# EAGLE design BM833 (EAGLE 9.6.2)

## Sheet 1 of 3
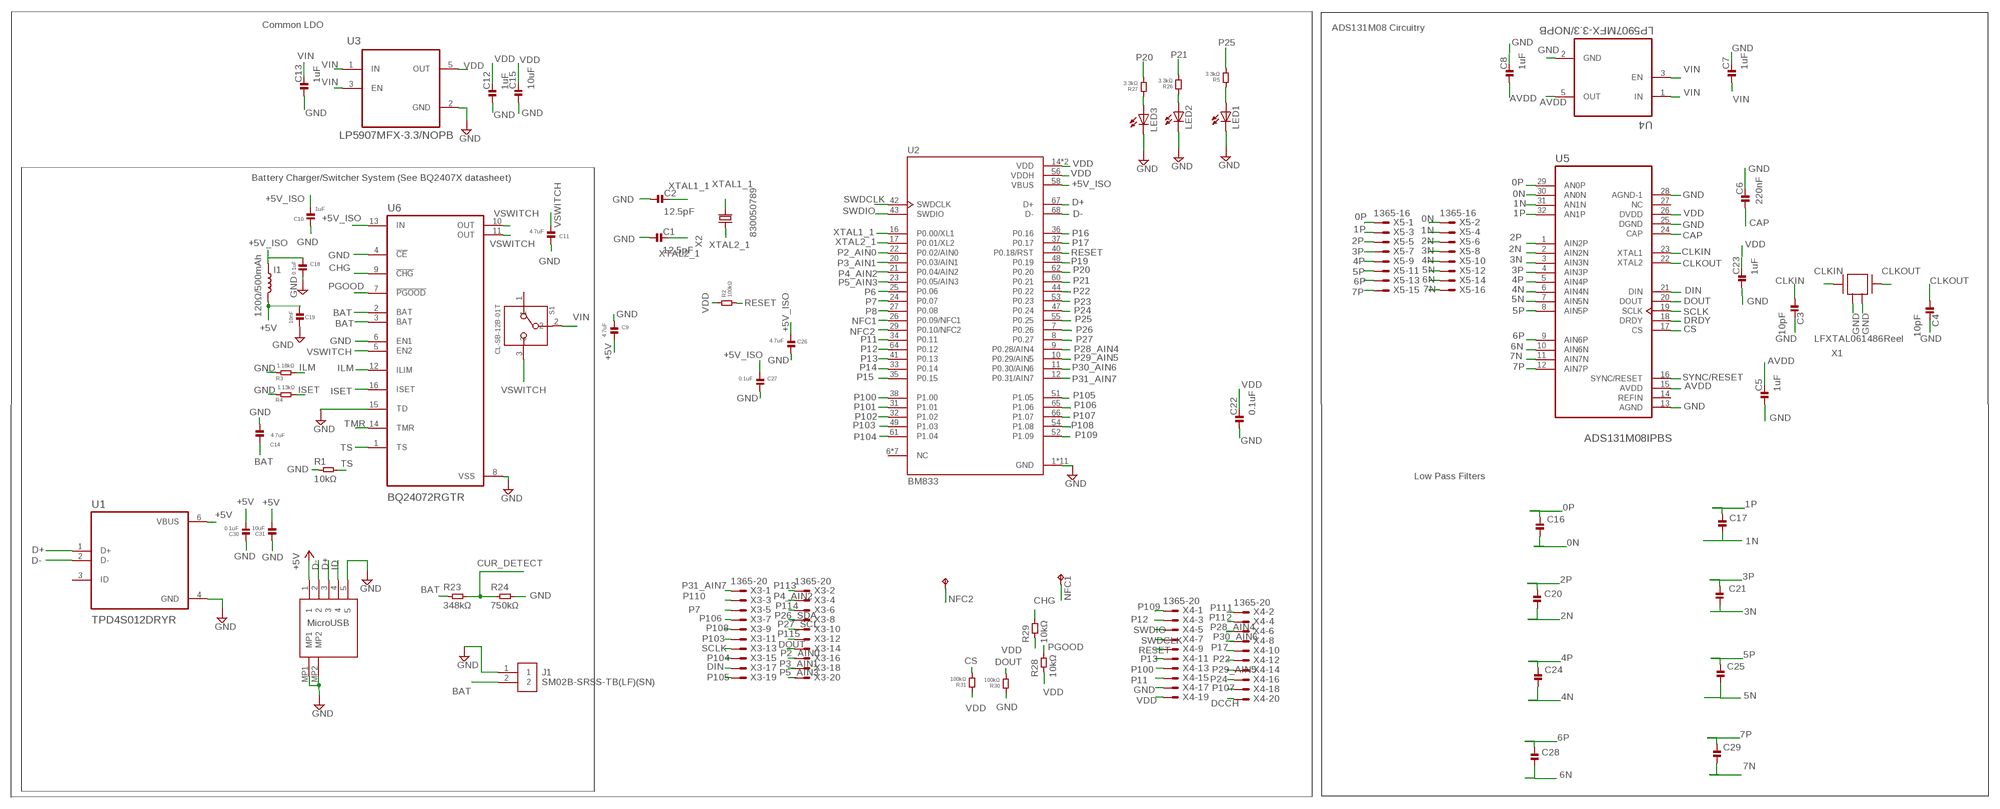
[diagram p0: schematic, sheet 1]

### Parts
C1  12.5pF  CAPACITOR.0201  [0201]
C2  12.5pF  CAPACITOR.0201  [0201]
C3  10pF  CAPACITOR.0201  [0201]
C4  10pF  CAPACITOR.0201  [0201]
C5  1uF  CAPACITOR.0201  [0201]
C6  220nF  CAPACITOR.0201  [0201]
C7  1uF  CAPACITOR.0201  [0201]
C8  1uF  CAPACITOR.0201  [0201]
C9  4.7uF  CAPACITOR.0201  [0201]
C10  1uF  CAPACITOR.0201  [0201]
C11  4.7uF  CAPACITOR.0201  [0201]
C12  1uF  CAPACITOR.0201  [0201]
C13  1uF  CAPACITOR.0201  [0201]
C14  4.7uF  CAPACITOR.0201  [0201]
C15  10uF  CAPACITOR.0402  [0402]
C16  100pF  CAPACITOR.0201  [0201]
C17  100pF  CAPACITOR.0201  [0201]
C18  0.1uF  CAPACITOR.0201  [0201]
C19  10nF  CAPACITOR.0201  [0201]
C20  100pF  CAPACITOR.0201  [0201]
C21  100pF  CAPACITOR.0201  [0201]
C22  0.1uF  CAPACITOR.0201  [0201]
C23  1uF  CAPACITOR.0201  [0201]
C24  100pF  CAPACITOR.0201  [0201]
C25  100pF  CAPACITOR.0201  [0201]
C26  4.7uF  CAPACITOR.0201  [0201]
C27  0.1uF  CAPACITOR.0201  [0201]
C28  100pF  CAPACITOR.0201  [0201]
C29  100pF  CAPACITOR.0201  [0201]
C30  0.1uF  CAPACITOR.0201  [0201]
C31  10uF  CAPACITOR.0402  [0402]
I1  120Ω/500mAh  12NH-0402  [0402_COILCRAFT]
J1  SM02B-SRSS-TB(LF)(SN)  [SM02B-SRSS-TB(LF)(SN)]
LED1  LEDCHIPLED_0603  [CHIPLED_0603]
LED2  LEDCHIPLED_0603  [CHIPLED_0603]
LED3  LEDCHIPLED_0603  [CHIPLED_0603]
NFC1  TPTP14SQ  [TP14SQ]
NFC2  TPTP14SQ  [TP14SQ]
R1  10kΩ  RESISTOR.0201  [0201]
R2  100kΩ  RESISTOR.0201  [0201]
R3  1.18kΩ  RESISTOR.0201  [0201]
R4  1.13kΩ  RESISTOR.0201  [0201]
R5  3.3kΩ  RESISTOR.0201  [0201]
R23  348kΩ  RESISTOR.0201  [0201]
R24  750kΩ  RESISTOR.0201  [0201]
R26  3.3kΩ  RESISTOR.0201  [0201]
R27  3.3kΩ  RESISTOR.0201  [0201]
R28  10kΩ  RESISTOR.0402  [0402]
R29  10kΩ  RESISTOR.0402  [0402]
R30  100kΩ  RESISTOR.0402  [0402]
R31  100kΩ  RESISTOR.0402  [0402]
S1  CL-SB-12B-01T  [CL-SB-12B]
U1  TPD4S012DRYR  [PSON50P145X100X60-6N]
U2  BM833  [XCVR_BM833]
U3  LP5907MFX-3.3/NOPB  [SOT95P280X145-5N]
U4  LP5907MFX-3.3/NOPB  [SOT95P280X145-5N]
U5  ADS131M08IPBS  [QFP50P700X700X120-32N]
U6  BQ24072RGTR  [QFN50P300X300X100-17N]
U7  DX4R005JJ2R1800  [DX4R005JJ2R1800]
X1  ABM3B-8.000MHZ-B2-T  [ABM3B-8.000MHZ-B2-T]
X2  FC-12M  [FC-12M]
X3  1365-20  [1365-20]
X4  1365-20  [1365-20]
X5  1365-16  [1365-16]

### Nets
0N: C16.2 U5.30(AN0N) X5.2
0P: C16.1 U5.29(AN0P) X5.1
1N: C17.2 U5.31(AN1N) X5.4
1P: C17.1 U5.32(AN1P) X5.3
2N: C20.2 U5.2(AIN2N) X5.6
2P: C20.1 U5.1(AIN2P) X5.5
3N: C21.2 U5.3(AIN3N) X5.8
3P: C21.1 U5.4(AIN3P) X5.7
4N: C24.2 U5.6(AIN4N) X5.10
4P: C24.1 U5.5(AIN4P) X5.9
5N: C25.2 U5.7(AIN5N) X5.12
5P: C25.1 U5.8(AIN5P) X5.11
6N: C28.2 U5.10(AIN6N) X5.14
6P: C28.1 U5.9(AIN6P) X5.13
7N: C29.2 U5.11(AIN7N) X5.16
7P: C29.1 U5.12(AIN7P) X5.15
+5V: C9.2 C19.2 C30.2 C31.2 I1.P$2 U1.6(VBUS) U7.1
+5V_ISO: C10.2 C18.1 C26.2 C27.2 I1.P$1 U2.58(VBUS) U6.13(IN)
AVDD: C5.2 C8.1 U4.5(OUT) U5.15(AVDD)
BAT: C14.2 J1.2 R23.1 U6.2(BAT) U6.3(BAT)
CAP: C6.1 U5.24(CAP)
CHG: R29.2 U6.9(!CHG)
CLKIN: C3.1 U5.23(XTAL1) X1.1
CLKOUT: C4.1 U5.22(XTAL2) X1.3
CS: R31.1 U5.17(CS)
CUR_DETECT: R23.2 R24.1
D+: U1.1(D+) U2.67(D+) U7.3
D-: U1.2(D-) U2.68(D-) U7.2
DCCH: X4.20
DIN: U5.21(DIN) X3.17
DOUT: R30.1 U5.20(DOUT) X3.14
DRDY: U5.18(DRDY)
GND: C1.1 C2.1 C3.2 C4.2 C5.1 C6.2 C7.2 C8.2 C9.1 C10.1 C11.1 C12.1 C13.1 C14.1 C15.1 C18.2 C19.1 C22.1 C23.1 C26.1 C27.1 C30.1 C31.1 J1.1 LED1.C LED2.C LED3.C R1.1 R3.1 R4.1 R24.2 R30.2 U1.4(GND) U2.1(GND) U2.2(GND) U2.3(GND) U2.4(GND) U2.5(GND) U2.13(GND) U2.15(GND) U2.18(GND) U2.19(GND) U2.30(GND) U2.45(GND) U3.2(GND) U4.2(GND) U5.13(AGND) U5.25(DGND) U5.28(AGND-1) U6.4(!CE) U6.6(EN1) U6.8(VSS) U6.15(TD) U7.5 U7.MP1 U7.MP2 X1.2 X1.4 X4.17
ID: U7.4
ILM: R3.2 U6.12(ILIM)
ISET: R4.2 U6.16(ISET)
LED1: LED1.A R5.2
LED2: LED2.A R26.2
LED3: LED3.A R27.2
NFC1: NFC2.TP U2.26(P0.09/NFC1)
NFC2: NFC1.TP U2.29(P0.10/NFC2)
P2_AIN0: U2.22(P0.02/AIN0) X3.16
P3_AIN1: U2.20(P0.03/AIN1) X3.18
P4_AIN2: U2.21(P0.04/AIN2) X3.4
P5_AIN3: U2.23(P0.05/AIN3) X3.20
P6: U2.25(P0.06)
P7: U2.24(P0.07) X3.5
P8: U2.27(P0.08)
P11: U2.34(P0.11) X4.15
P12: U2.64(P0.12) X4.3
P13: U2.41(P0.13) X4.11
P14: U2.33(P0.14)
P15: U2.35(P0.15)
P16: U2.36(P0.16)
P17: U2.37(P0.17) X4.10
P19: U2.48(P0.19)
P20: R27.1 U2.62(P0.20)
P21: R26.1 U2.60(P0.21)
P22: U2.44(P0.22) X4.12
P23: U2.53(P0.23)
P24: U2.47(P0.24) X4.16
P25: R5.1 U2.55(P0.25)
P26: U2.7(P0.26)
P26_SDA: X3.8
P27: U2.8(P0.27)
P27_SCL: X3.10
P28_AIN4: U2.9(P0.28/AIN4) X4.6
P29_AIN5: U2.10(P0.29/AIN5) X4.14
P30_AIN6: U2.11(P0.30/AIN6) X4.8
P31_AIN7: U2.12(P0.31/AIN7) X3.1
P100: U2.38(P1.00) X4.13
P101: U2.31(P1.01)
P102: U2.32(P1.02)
P103: U2.49(P1.03) X3.11
P104: U2.61(P1.04) X3.15
P105: U2.51(P1.05) X3.19
P106: U2.65(P1.06) X3.7
P107: U2.66(P1.07) X4.18
P108: U2.54(P1.08) X3.9
P109: U2.52(P1.09) X4.1
P110: X3.3
P111: X4.2
P112: X4.4
P113: X3.2
P114: X3.6
P115: X3.12
PGOOD: R28.2 U6.7(!PGOOD)
RESET: R2.1 U2.40(P0.18/RST) X4.9
SCLK: U5.19(SCLK) X3.13
SWDCLK: U2.42(SWDCLK) X4.7
SWDIO: U2.43(SWDIO) X4.5
SYNC/RESET: U5.16(SYNC/RESET)
TMR: U6.14(TMR)
TS: R1.2 U6.1(TS)
VDD: C12.2 C15.2 C22.2 C23.2 R2.2 R28.1 R29.1 R31.2 U2.14(VDD) U2.28(VDD) U2.56(VDDH) U3.5(OUT) U5.26(DVDD) X4.19
VIN: C7.1 C13.2 S1.2 U3.1(IN) U3.3(EN) U4.1(IN) U4.3(EN)
VSWITCH: C11.2 S1.3 U6.5(EN2) U6.10(OUT) U6.11(OUT)
XTAL1_1: C2.2 U2.16(P0.00/XL1) X2.2
XTAL2_1: C1.2 U2.17(P0.01/XL2) X2.1
Unconnected: S1.1 U1.3(ID) U2.6(NC) U2.39(NC) U2.46(NC) U2.50(NC) U2.57(NC) U2.59(NC) U2.63(NC) U5.14(REFIN) U5.27(NC)

### Notes on the sheet
- Common LDO
- ADS131M08 Circuitry
- Battery Charger/Switcher System (See BQ2407X datasheet)
- 830050789
- LFXTAL061486Reel
- Low Pass Filters
- MicroUSB

## Sheet 2 of 3

## Sheet 3 of 3

## Library data of the parts
C1-C31 = standardparts:CAPACITOR
I1 = spkfncoils:12NH; MOUSER_PART: 994-0402HP-12NXGLU; PROD_ID: NDUC-15271; VALUE: 12nH
J1 = SM02B-SRSS-TB_LF__SN_:SM02B-SRSS-TB(LF)(SN): JST (JAPAN SOLDERLESS TERMINALS) - SM02B-SRSS-TB (LF)(SN) - HEADER, R/A, 2WAY Source: Datasheet <http://www.jst-mfg.com/product/pdf/eng/eSH.pdf> Check prices <https://pricing.snapeda.com/parts/SM02B-SRSS-TB%28LF%29%28SN%29/JST%20Sales/view-part?ref=eda>; AVAILABILITY: In Stock; DESCRIPTION: Connector Header Surface Mount, Right Angle 2 position 0.039 (1.00mm); MF: JST Sales; MP: SM02B-SRSS-TB(LF)(SN); PACKAGE: None; PRICE: None
LED1-LED3 = adafruit:LED: LED OSRAM: - CHIPLED LG R971, LG N971, LY N971, LG Q971, LY Q971, LO R971, LY R971 LH N974, LH R974 LS Q976, LO Q976, LY Q976 LO Q996 - Hyper CHIPLED LW Q18S LB Q993, LB Q99A, LB R99A - SideLED LS A670, LO A670, LY A670, LG A670, LP A670 LB A673, LV A673, LT A673, LW A673 LH A674 LY A675 LS A676, LA A676, LO A676, LY A676, LW A676 LS A679, LY A679, LG A679 - Hyper Micro SIDELED® LS Y876, LA Y876, LO Y876, LY Y876 LT Y87S - SmartLED LW L88C, LW L88S LB L89C, LB L89S, LG L890 LS L89K, LO L89K, LY L89K LS L896, LA L896, LO L896, LY L896 - TOPLED LS T670, LO T670, LY T670, LG T670, LP T670 LSG T670, LSP T670, LSY T670, LOP T670, LYG T670 LG T671, LOG T671, LSG T671 LB T673, LV T673, LT T673, LW T673 LH T674 LS T676, LA T676, LO T676, LY T676, LB T676, LH T676, LSB T676, LW T676 LB T67C, LV T67C, LT T67C, LS T67K, LO T67K, LY T67K, LW E67C LS E67B, LA E67B, LO E67B, LY E67B, LB E67C, LV E67C, LT E67C LW T67C LS T679, LY T679, LG T679 LS T770, LO T770, LY T770, LG T770, LP T770 LB T773, LV T773, LT T773, LW T773 LH T774 LS E675, LA E675, LY E675, LS T675 LS T776, LA T776, LO T776, LY T776, LB T776 LHGB T686 LT T68C, LB T68C - Hyper Mini TOPLED® LB M676 - Mini TOPLED Santana® LG M470 LS M47K, LO M47K, LY M47K Source: http://www.osram.convergy.de/
NFC1 NFC2 = testpad:TP: Test pad
R1 R2 R4 R5 R23 R24 R26-R31 = standardparts:RESISTOR
R3 = standardparts:RESISTOR; SPICEPREFIX: R
S1 = CL-SB-12B-01T:CL-SB-12B-01T: Check prices <https://pricing.snapeda.com/parts/CL-SB-12B-01T/Nidec%20Copal/view-part?ref=eda>; AVAILABILITY: In Stock; DESCRIPTION: Slide Switch SPDT Surface Mount; MF: Nidec Copal; MP: CL-SB-12B-01T; PACKAGE: None; PRICE: None
U1 = TPD4S012DRYR:TPD4S012DRYR: Check prices <https://pricing.snapeda.com/parts/TPD4S012DRYR/Texas%20Instruments/view-part?ref=eda>; AVAILABILITY: In Stock; DESCRIPTION: 4-channel USB ESD solution with power clamp 6-SON -40 to 85; MF: Texas Instruments; MP: TPD4S012DRYR; PACKAGE: USON-6 Texas Instruments; PRICE: None; PURCHASE-URL: https://pricing.snapeda.com/search/part/TPD4S012DRYR/?ref=eda
U2 = BM833:BM833: Check availability <https://pricing.snapeda.com/parts/BM833/Fanstel/view-part?ref=eda>; AVAILABILITY: In Stock; DESCRIPTION: 802.15.4, Bluetooth Bluetooth v5.1 Transceiver Module 2.4GHz PCB Trace Surface Mount; MF: Fanstel; MP: BM833; PACKAGE: None; PRICE: None; PURCHASE-URL: https://pricing.snapeda.com/search/part/BM833/?ref=eda
U3 U4 = LP5907MFX-3.3_NOPB:LP5907MFX-3.3/NOPB: IC REG LINEAR 3.3V 250MA SOT23; AVAILABILITY: Unavailable; DESCRIPTION: Linear Voltage Regulator IC 1 Output 250mA SOT-23-5; MF: Texas Instruments; MP: LP5907MFX-3.3/NOPB; PACKAGE: SOT-23 Texas Instruments; PRICE: None
U5 = ADS131M08IPBS:ADS131M08IPBS: None Check prices <https://pricing.snapeda.com/parts/ADS131M08IPBS/Texas%20Instruments/view-part?ref=eda>; AVAILABILITY: Warning; DESCRIPTION: 24-bit 32-kSPS 8-channelsimultaneous-sampling delta-sigma ADC 32-TQFP -40 to 125; MF: Texas Instruments; MP: ADS131M08IPBS; PACKAGE: TQFP-32 Texas Instruments; PRICE: None; PURCHASE-URL: https://pricing.snapeda.com/search/part/ADS131M08IPBS/?ref=eda
U6 = BQ24072RGTR:BQ24072RGTR: Check prices <https://pricing.snapeda.com/parts/BQ24072RGTR/Texas%20Instruments/view-part?ref=eda>; AVAILABILITY: In Stock; DESCRIPTION: Standalone 1-cell 1.5-A linear charger, Power Path, 4.2-V VBAT and VOUT=VBAT + 225mV 16-VQFN -40 to 85; MF: Texas Instruments; MP: BQ24072RGTR; PACKAGE: VQFN-16 Texas Instruments; PRICE: None; PURCHASE-URL: https://pricing.snapeda.com/search/part/BQ24072RGTR/?ref=eda
U7 = DX4R005JJ2R1800:DX4R005JJ2R1800: Check prices <https://pricing.snapeda.com/parts/DX4R005JJ2R1800/JAE%20Electronics/view-part?ref=eda>; AVAILABILITY: In Stock; DESCRIPTION: USB - micro B USB 2.0 Receptacle Connector 5 Position Surface Mount, Right Angle; Through Hole; MF: JAE Electronics; MP: DX4R005JJ2R1800; PACKAGE: None; PRICE: None
X1 = Crystals_Oscillators:ABM3B-8.000MHZ-B2-T: CRYSTAL 8.0000MHZ 18PF SMD Manufacturer's datasheet <https://abracon.com/Resonators/abm3b.pdf>; CREATED_BY: PCBLayout.com; DIGIKEY_PART_NUMBER: 535-9720-2-ND; MANUFACTURER: Abracon LLC; MPN: ABM3B-8.000MHZ-B2-T; PACKAGE: SMD 4
X2 = crystal:FC-12M: kHz RANGE CRYSTAL UNIT LOW PROFILE SMD Source: Epson Toyocom FC-12M.pdf
X3 X4 = con-leotronics:1365-20: DUAL ROW STRAIGHT HEADER 1364 SERIES. 1.27mm x 1.27mm. Without Fixing Post. SMT Source: http://www.leotronics.co.uk/Conexcon/Data%20Sheets/sec.%20A/1364ing.pdf; OC_FARNELL: unknown; OC_NEWARK: unknown
X5 = con-leotronics:1365-16: DUAL ROW STRAIGHT HEADER 1364 SERIES. 1.27mm x 1.27mm. Without Fixing Post. SMT Source: http://www.leotronics.co.uk/Conexcon/Data%20Sheets/sec.%20A/1364ing.pdf; OC_FARNELL: unknown; OC_NEWARK: unknown

## Board
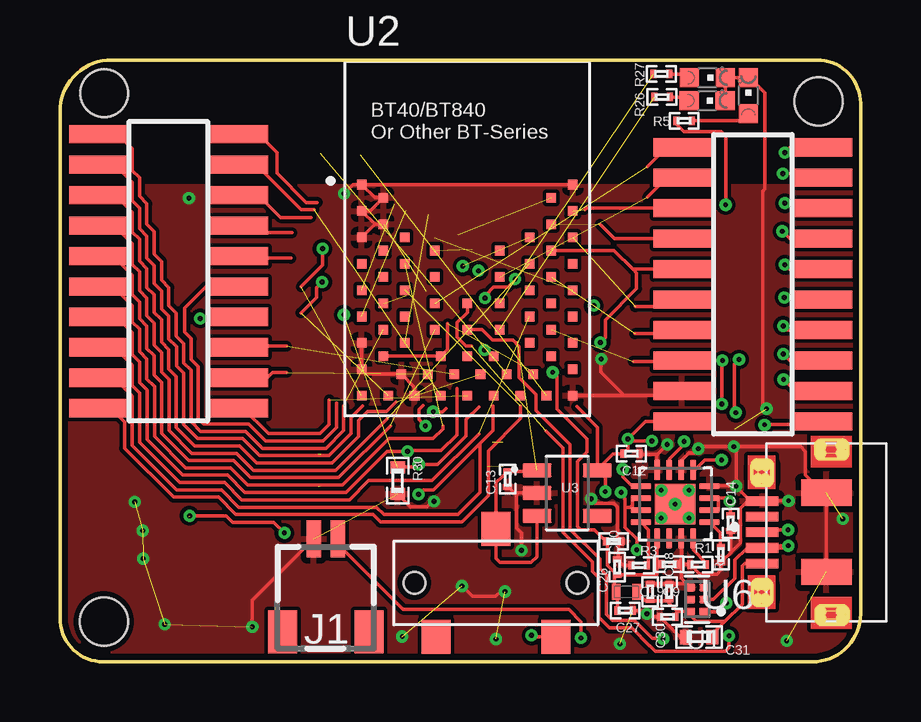
[diagram p1: board, top side]
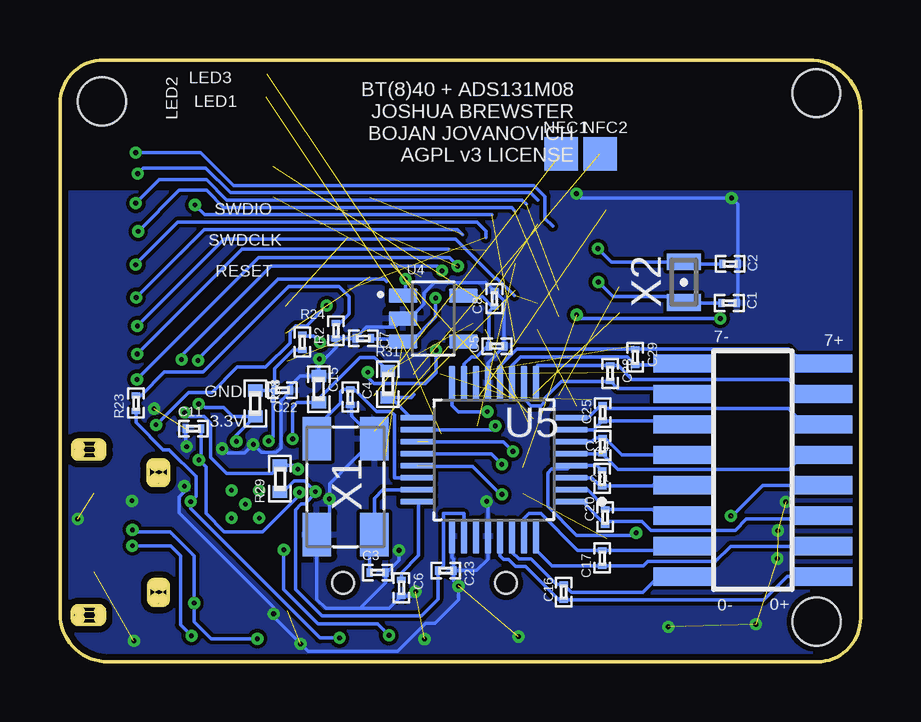
[diagram p2: board, bottom side, seen from below]

Size 33.38 x 25.1 mm. Coordinates in mm from the lower left corner, seen from the top.
Outline: 31.75,1.56 arc-90 31.52,1.79 31.52,2.1 arc-90 31.75,2.34 32.62,2.34 arc-90 32.85,2.1 32.85,1.79 arc-90 32.63,1.56 31.75,1.56
Outline: 31.74,8.45 arc-90 31.51,8.68 31.51,8.98 arc-90 31.74,9.25 32.62,9.25 arc-90 32.84,8.98 32.84,8.68 arc-90 32.62,8.45 31.74,8.45
Outline: 29.67,2.59 arc-90 29.44,2.36 29.1,2.36 arc-90 28.87,2.59 28.87,3.2 arc-90 29.1,3.43 29.44,3.43 arc-90 29.67,3.2 29.67,2.59
Outline: 29.7,7.58 arc-90 29.47,7.35 29.13,7.35 arc-90 28.85,7.58 28.85,8.2 arc-90 29.13,8.42 29.47,8.42 arc-90 29.7,8.19 29.7,7.58
Outline: 33.38,2.01 arc-90 31.37,0 1.8,0 arc-90 0,1.83 0,22.94 arc-90 2.16,25.1 31.55,25.1 arc-90 33.38,23.29 33.38,2.01
Copper layers (1*16): Top 0.035mm / dielectric 1.5mm / Bottom 0.035mm
Design rules "default *": minimum track width 4mil, minimum drill 0.2mm, track to track 6mil, track to pad 6mil, pad to pad 6mil, via to via 6mil, smd to smd 6mil, copper to edge 10mil, drill to drill 6mil, minimum pad ring 6mil, minimum via ring 6mil, stop-mask expansion 4mil, vias tented up to drill 20mil, thermal gap 10mil
Holes 2 mm at 1.84,23.71 31.62,23.36 1.83,1.67

### Footprints (pad centres in the part's own frame; a part is rotated, then mirrored left to right if it is on the bottom)
0201 = smd 0.25 x 0.35: 1 -0.325,0; 2 0.325,0
0402 = smd 0.5 x 0.6: 1 -0.55,0; 2 0.55,0
0402_COILCRAFT = smd 0.356 x 0.66: P$1 -0.432,0; P$2 0.432,0
SM02B-SRSS-TB(LF)(SN) = smd 0.6 x 1.55: 1 -0.5,1.975; 2 0.5,1.975 | smd 1.2 x 1.8: 3 -1.8,-1.9; 4 1.8,-1.9
CHIPLED_0603 = smd 0.8 x 0.8: A 0,-0.75; C 0,0.75
TP14SQ = smd 1.4 x 1.4: TP 0,0
CL-SB-12B = smd 1.2 x 1.4: 1 -2.5,-2.25; 2 0,2.25; 3 2.5,-2.25 | hole 0.9: 3.4,0; -3.4,0
PSON50P145X100X60-6N = smd 0.42 x 0.3: 1 -0.29,0.5 | smd 0.41 x 0.3: 2 -0.295,0; 3 -0.295,-0.5; 4 0.295,-0.5; 5 0.295,0; 6 0.295,0.5
XCVR_BM833 = smd 0.4 x 0.4: 1 -4.4,2.35; 2 -3.5,1.8; 3 -4.4,1.25; 4 -3.5,0.7; 5 -4.4,0.15; 6 -3.5,-0.4; 7 -4.4,-0.95; 8 -3.5,-1.5; 9 -4.4,-2.05; 10 -3.5,-2.6; 11 -4.4,-3.15; 12 -3.5,-3.7; 13 -4.4,-4.25; 14 -3.5,-4.8; 15 -4.4,-5.35; 16 -4.4,-6.45; 17 -3.3,-6.45; 18 -2.75,-5.55; 19 -2.2,-6.45; 20 -1.65,-5.55; 21 -1.1,-6.45; 22 -0.55,-5.55; 23 0,-6.45; 24 0.55,-5.55; 25 1.1,-6.45; 26 1.65,-5.55; 27 2.2,-6.45; 28 2.75,-5.55; 29 3.3,-6.45; 30 4.4,-6.45; 31 4.4,-5.35; 32 3.5,-4.8; 33 4.4,-4.25; 34 3.5,-3.7; 35 4.4,-3.15; 36 3.5,-2.6; 37 4.4,-2.05; 38 3.5,-1.5; 39 4.4,-0.95; 40 3.5,-0.4; 41 4.4,0.15; 42 3.5,0.7; 43 4.4,1.25; 44 3.5,1.8; 45 4.4,2.35; 46 1.35,-0.4; 47 -1.35,-0.4; 48 -2.6,0.15; 49 -2.6,-0.95; 50 -1.35,-1.5; 51 -2.6,-2.05; 52 -1.35,-2.6; 53 -2.6,-3.15; 54 -1.35,-3.7; 55 -2.6,-4.25; 56 -1.1,-4.8; 57 0,-4.8; 58 1.1,-4.8; 59 2.6,-4.25; 60 1.35,-3.7; 61 2.6,-3.15; 62 1.35,-2.6; 63 2.6,-2.05; 64 1.35,-1.5; 65 2.6,-0.95; 66 2.6,0.15; 67 0,-3.7; 68 0,-2.6
SOT95P280X145-5N = smd 1.21 x 0.59: 1 -1.255,0.95; 2 -1.255,0; 3 -1.255,-0.95; 4 1.255,-0.95; 5 1.255,0.95
QFP50P700X700X120-32N = smd 1.44 x 0.26: 1 -3.195,1.75; 2 -3.195,1.25; 3 -3.195,0.75; 4 -3.195,0.25; 5 -3.195,-0.25; 6 -3.195,-0.75; 7 -3.195,-1.25; 8 -3.195,-1.75; 17 3.195,-1.75; 18 3.195,-1.25; 19 3.195,-0.75; 20 3.195,-0.25; 21 3.195,0.25; 22 3.195,0.75; 23 3.195,1.25; 24 3.195,1.75 | smd 0.26 x 1.44: 9 -1.75,-3.195; 10 -1.25,-3.195; 11 -0.75,-3.195; 12 -0.25,-3.195; 13 0.25,-3.195; 14 0.75,-3.195; 15 1.25,-3.195; 16 1.75,-3.195; 25 1.75,3.195; 26 1.25,3.195; 27 0.75,3.195; 28 0.25,3.195; 29 -0.25,3.195; 30 -0.75,3.195; 31 -1.25,3.195; 32 -1.75,3.195
QFN50P300X300X100-17N = smd 0.86 x 0.26: 1 -1.435,0.75; 2 -1.435,0.25; 3 -1.435,-0.25; 4 -1.435,-0.75; 9 1.435,-0.75; 10 1.435,-0.25; 11 1.435,0.25; 12 1.435,0.75 | smd 0.26 x 0.86: 5 -0.75,-1.435; 6 -0.25,-1.435; 7 0.25,-1.435; 8 0.75,-1.435; 13 0.75,1.435; 14 0.25,1.435; 15 -0.25,1.435; 16 -0.75,1.435 | smd 1.68 x 1.68: 17 0,0 | drill 0.2 pad 0.4: 18 0,0; 19 -0.58,0.58; 20 0.58,0.58; 21 -0.58,-0.58; 22 0.58,-0.58
DX4R005JJ2R1800 = smd 1.35 x 0.4: 1 1.525,1.3; 2 1.525,0.65; 3 1.525,0; 4 1.525,-0.65; 5 1.525,-1.3 | smd 2.1 x 1.1: MP1 -1.15,1.65; MP2 -1.15,-1.65
ABM3B-8.000MHZ-B2-T = smd 1.8 x 1.2: 1 -2,-1.2; 2 2,-1.2; 3 2,1.2; 4 -2,1.2
FC-12M = smd 0.7 x 1.4: 1 -0.85,0; 2 0.85,0
1365-20 = smd 0.76 x 2.4: 1 -5.715,-2.95; 2 -5.715,2.95; 3 -4.445,-2.95; 4 -4.445,2.95; 5 -3.175,-2.95; 6 -3.175,2.95; 7 -1.905,-2.95; 8 -1.905,2.95; 9 -0.635,-2.95; 10 -0.635,2.95; 11 0.635,-2.95; 12 0.635,2.95; 13 1.905,-2.95; 14 1.905,2.95; 15 3.175,-2.95; 16 3.175,2.95; 17 4.445,-2.95; 18 4.445,2.95; 19 5.715,-2.95; 20 5.715,2.95
1365-16 = smd 0.76 x 2.4: 1 -4.445,-2.95; 2 -4.445,2.95; 3 -3.175,-2.95; 4 -3.175,2.95; 5 -1.905,-2.95; 6 -1.905,2.95; 7 -0.635,-2.95; 8 -0.635,2.95; 9 0.635,-2.95; 10 0.635,2.95; 11 1.905,-2.95; 12 1.905,2.95; 13 3.175,-2.95; 14 3.175,2.95; 15 4.445,-2.95; 16 4.445,2.95

### Placement (x,y rotation side)
C1  5.47,14.96 180 bottom
C2  5.44,16.59 180 bottom
C3  20.14,3.72 0 bottom
C4  21.28,11.04 270 bottom
C5  15.16,13.16 180 bottom
C6  19.14,3.08 270 bottom
C7  20.73,13.48 180 bottom
C8  15.26,15.14 90 bottom
C9  25.4,2.92 270 top
C10  23.09,5.02 180 top
C11  27.81,9.72 0 bottom
C12  23.82,8.68 180 top
C13  18.67,7.61 90 top
C14  27.95,5.78 90 top
C15  22.59,11.37 270 bottom
C16  12.38,2.91 90 bottom
C17  10.77,4.33 90 bottom
C18  25.4,4.07 0 top
C19  24.61,2.92 270 top
C20  10.65,6.04 90 bottom
C21  10.77,7.65 270 bottom
C22  24.1,11.32 180 bottom
C23  17.29,3.8 180 bottom
C24  10.76,9.02 90 bottom
C25  10.75,10.39 270 bottom
C26  23.23,3.95 270 top
C27  23.56,2.14 180 top
C28  10.43,12.02 270 bottom
C29  9.39,12.7 270 bottom
C30  25.33,1.88 0 top
C31  26.64,1.04 0 top
I1  23.61,2.92 0 top
J1  11.08,3.15 0 top
LED1  28.7,23.61 0 top
LED2  26.98,23.4 270 top
LED3  26.99,24.36 270 top
NFC1  12.49,21.19 0 bottom
NFC2  10.86,21.19 0 bottom
R1  27.55,4.46 90 top
R2  23.28,13.33 270 bottom
R3  24.15,4.02 0 top
R4  26.6,4.06 0 top
R5  26.02,22.56 0 top
R23  30.2,10.79 90 bottom
R24  21.87,13.8 270 bottom
R26  25.1,23.55 0 top
R27  25.07,24.51 0 top
R28  25.24,10.77 270 bottom
R29  24.2,7.63 90 bottom
R30  14.08,7.55 270 top
R31  19.7,11.58 90 bottom
S1  18.17,3.29 0 top
U1  26.57,2.6 180 top
U2  16.98,17.55 0 top
U3  21.15,7.04 0 top
U4  17.81,14.31 0 bottom
U5  15.28,8.43 180 bottom
U6  25.65,6.57 180 top
U7  30.8,5.4 180 top
X1  21.47,7.3 90 bottom
X2  7.37,15.83 90 bottom
X3  4.53,16.29 270 top
X4  28.89,15.74 270 top
X5  4.49,8 90 bottom

### Tracks (layer width: path | path; a pad name or v marks a point on that pad's centre or on a via)
0N
  Bottom 0.152: U5.30 14.54,4.57 14.25,4.28 13.73,4.28 12.68,3.23 C16.2 12.05,2.91 9.08,2.91 8.44,3.55 X5.2
0P
  Bottom 0.152: X5.1 3.05,3.55 4.03,2.58 C16.1 | 12.41,2.62 C16.1 | C16.1 12.57,2.58 13.96,3.97 14.38,3.97 14.68,4.28 14.89,4.28 15.03,4.42 U5.29
1N
  Bottom 0.152: X5.4 7.8,4.82 7.97,4.66 C17.2 11.8,4.66 13.33,6.18 13.82,6.18 14.03,5.97 U5.31
1P
  Bottom 0.152: U5.32 13.53,4.62 13.52,4.6 13.46,4.6 12.86,4 C17.1 | 1.57,4.78 X5.3 5.41,4.82 6.05,4.19 8.86,4.19 9.05,4 C17.1 | C17.1
2N
  Bottom 0.152: U5.2 11.38,7.18 10.65,6.45 C20.2 8.68,6.36 8.41,6.09 X5.6
2P
  Bottom 0.152: U5.1 11.45,6.68 11.45,6.54 10.65,5.73 C20.1 10.5,5.86 9.11,5.86 8.73,5.48 5.22,5.48 4.75,5.95 1.67,5.95 X5.5
3N  (1 unrouted)
  Bottom 0.152: 7.62,7.54 7.6,7.52 | 7.6,7.52 X5.8 | U5.3 12.07,7.66 11.19,7.66 10.86,7.33 | C21.2 8.67,7.33 8.47,7.52 7.6,7.52
3P  (via drill 0.2)  (1 unrouted)
  Top 0.152: v9.36,5.37 8.91,5.82 7.2,5.82 6.93,6.09 v5.4,6.09
  Bottom 0.152: 5.37,6.06 4.07,7.36 X5.7 | 10.76,7.97 C21.1 10.98,8.18 U5.4 12.23,8.04 12.88,8.04 13.04,7.88 13.04,6.47 11.84,5.28 9.36,5.28 v9.36,5.37
4N
  Bottom 0.152: X5.10 9.95,8.63 10.66,9.34 C24.2 11.04,9.34 11.19,9.19 U5.6
4P  (1 unrouted)
  Bottom 0.152: X5.9 2.38,8.63 2.99,8.02 10.11,8.02 10.76,8.67 C24.1 | U5.5 10.89,8.68
5N
  Bottom 0.152: U5.7 11.13,9.68 C25.2 10.74,10.05 7.59,10.05 X5.12
5P
  Bottom 0.152: X5.11 2.35,9.9 3.01,10.56 10.6,10.56 C25.1 10.82,10.71 11.34,10.19 12.08,10.19 U5.8
6N
  Bottom 0.152: X5.14 7.66,11.39 10.13,11.39 C28.2 10.45,11.68 12.48,11.68 13.17,10.99 13.17,10.83 13.33,10.67 13.74,10.67 14.02,10.96 14.02,11.61 U5.10
6P
  Bottom 0.152: X5.13 2.39,11.17 3,11.78 9.54,11.78 10.1,12.35 C28.1 10.73,12.35 13.46,12.35 13.53,12.28 U5.9
7N
  Bottom 0.152: 7.14,12.74 X5.16 7.51,12.37 C29.2 9.73,12.71 14.19,12.71 14.53,12.36 U5.11
7P
  Bottom 0.152: 9.39,13.06 C29.1 9.36,13.05 | U5.12 15.03,12.33 14.32,13.05 9.36,13.05 | 9.36,13.05 2.98,13.05 2.38,12.44 X5.15
+5V
  Top 0.152: U7.1 28.54,4.1 28.44,4 28.44,2.4 27.72,1.68 | 27.72,1.68 26.54,1.68 26.27,1.95 U1.6 25.75,2.1 | 25.75,2.1 25.4,2.45 | 25.4,2.45 25.3,2.55 24.66,2.55 | 24.66,2.55 24.41,2.55 I1.P$2 | 25.4,2.45 C9.2 | C19.2 24.66,2.55 | C30.2 25.65,2 25.75,2.1 | C31.2 27.2,1.16 27.72,1.68
+5V_ISO  (via drill 0.2)
  Top 0.152: U6.13 24.89,4.06 | 24.89,4.06 24.89,3.62 C26.2 | C18.1 24.89,4.06 | C26.2 23.21,3.62 22.82,4.01 22.82,4.96 C10.2 22.27,5.51 21.72,5.51 21.57,5.66 21.57,8.35 21.97,8.75 21.97,9.29 20.72,10.54 20.72,11.9 v20.54,12.08 | C26.2 23.12,3.51 23.12,2.98 I1.P$1 23.24,2.86 C27.2 | 17.82,12.99 17.84,12.99 U2.58 17.82,13.01 v17.7,13.01
  Bottom 0.152: v20.54,12.08 20.54,11.86 20.27,11.6 18.14,11.6 17.7,12.04 v17.7,13.01
AVDD
  Bottom 0.152: U4.5 16.52,15.22 15.77,15.22 15.36,14.82 C8.1 15.49,14.6 C5.2 15.56,13.16 16.01,12.72 16.22,12.72 16.53,12.41 U5.15
BAT  (via drill 0.2)
  Top 0.152: U6.2 27.45,6.32 27.45,6.81 27.43,6.82 | J1.2 11.63,5.12 11.65,5.1 11.65,4.84 14.3,2.19 21.21,2.19 21.72,1.68 v21.72,0.99 | 27.43,6.82 27.78,6.82 v27.93,6.68 27.95,6.65 C14.2 | 27.43,6.82 U6.3
  Bottom 0.152: v21.72,0.99 22.53,0.99 27.93,6.39 v27.93,6.68 27.71,6.9 27.71,7.73 28.82,8.84 29.06,8.84 30.2,9.98 R23.1
CAP
  Bottom 0.152: U5.24 18.43,6.63 18.43,4.43 19.14,3.72 C6.1
CHG  (via drill 0.2)
  Top 0.152: U6.9 23.85,7.32 23.46,7.71 v23.46,8.03 v23.46,8.04 | v28.31,12.61 28.12,12.41 28.12,10.44 v28.17,10.39 v28.18,10.39
  Bottom 0.152: v23.46,8.04 23.61,8.18 R29.2 24.53,7.86 26.43,7.86 27.1,8.52 27.1,9.96 27.37,10.24 28.02,10.24 v28.18,10.39 | v17.45,16.31 17.65,16.5 24.57,16.5 28.39,12.69 v28.31,12.61
CLKIN
  Bottom 0.152: U5.23 19.92,7.17 20.27,6.82 X1.1 20.46,5.11 C3.1 | C3.1
CLKOUT
  Bottom 0.152: X1.3 22.67,9.8 21.68,10.79 21.68,11.27 21.59,11.36 C4.1 21.1,11.36 20.18,10.45 19.59,10.45 19.43,10.29 19.43,7.68 U5.22
CS
  Bottom 0.152: U5.17 18.73,10.18 19.58,11.03 R31.1 18.72,11.03 18.61,11.14
CUR_DETECT
  Bottom 0.152: R24.1 21.7,14.13 21.32,14.51 21.32,14.62 21.32,15.23 21.73,15.64 22.45,15.64 22.45,15.65 23.83,15.65 27.4,12.08 29.03,12.08 30,11.11 R23.2
D+  (via drill 0.2)
  Top 0.152: U7.3 29.38,5.51 v30.35,5.51 | v27.78,2.45 27.42,2.09 26.87,2.09 U1.1 | v25.15,0.96 25.13,0.98 24.7,0.98 23.96,1.73 23.02,1.73 22.77,1.98 22.77,3.63 22.51,3.89 22.51,4.28 21.26,5.53 21.26,9.07 19.85,10.48 19.85,11.15 19.14,11.85 19.14,13.15 18.88,13.41 18.03,13.41 17.6,13.85 U2.67
  Bottom 0.152: v30.35,5.51 30.26,5.41 28.77,5.41 27.78,4.42 v27.78,2.45 27.78,1.67 27.07,0.96 v25.15,0.96
D-  (via drill 0.2)  (1 unrouted)
  Top 0.152: U1.2 27.25,2.6 28.13,3.49 28.13,4.25 28.63,4.74 28.69,4.74 28.7,4.75 U7.2 30.27,4.75 v30.36,4.84 29.13,4.84 | 20.26,9.62 20.96,8.92 20.96,5.55 20.96,5.41 22.21,4.16 22.21,3.76 22.47,3.5 22.47,1.85 22.91,1.41 23.84,1.41 24.58,0.68 24.59,0.68 24.82,0.44 27.74,0.44 27.89,0.59 v27.89,1.08 | U2.68 16.98,14.57 16.55,14.14 16.55,13.55 16.93,13.17 17.16,13.17
  Bottom 0.152: v27.89,1.08 28.35,1.54 28.35,4.42 28.77,4.84 v30.36,4.84
DCCH  (via drill 0.2)
  Top 0.152: v29.37,9.88 v29.38,9.89 31.7,9.89 X4.20
  Bottom 0.152: v29.37,9.88 29.36,9.88 28.01,11.24 27.03,11.24 25.99,12.28 24.81,12.28 23.79,13.3 23.79,13.76 23.55,14.01 23.1,14.01 v22.25,14.85
DIN  (via drill 0.2)  (1 unrouted)
  Top 0.152: 17.51,9.11 18.05,9.65 18.05,10.66 18.05,10.67 | 17.51,9.11 15.57,7.18 15.15,7.18 v14.95,6.98 | 17.51,9.11 17.51,7.06 16.59,6.14 13.51,6.14 13.2,6.45 7.46,6.45 6.73,7.17 4.86,7.17 3.02,9.02 3.02,9.25 3.01,9.26 3.01,11.08 2.25,11.84 X3.17
  Bottom 0.152: v14.95,6.98 15,6.98 16.18,8.16 17.82,8.16
DOUT  (via drill 0.2)  (1 unrouted)
  Top 0.152: 17.47,10.63 16.94,10.1 16.94,9.41 15.74,8.22 14.97,8.22 v14.96,8.23 14.85,8.12 14.1,8.12 R30.1 | v5.85,14.32 5.86,14.3 6.37,14.3 6.45,14.38 X3.14
  Bottom 0.152: v14.96,8.23 15.39,8.67 U5.20 | v11.83,14.47 11.68,14.31 5.88,14.31 5.87,14.32 v5.85,14.32
DRDY  (via drill 0.2)
  Top 0.152: v15.23,9.83 14.96,10.11 14.96,10.53 15.12,10.7
  Bottom 0.152: U5.18 15.39,9.67 v15.23,9.83
GND  (via drill 0.2)  (13 unrouted)
  Top 0.152: U6.15 25.9,4.06 | 25.9,4.06 25.9,3.48 U1.4 26.12,3.25 C9.1 C19.1 | U6.4 v28.19,7.32 | U7.5 28.78,6.7 28.19,7.29 v28.19,7.32 | v28.19,7.32 28.19,8.82 28.04,8.97 | 28.02,8.99 28.04,8.97 | U7.MP1 U7.MP2 31.83,7.05 31.08,7.8 31.08,8.01 31.07,8.01 31.07,8.77 30.87,8.97 28.04,8.97 | v22.56,12.63 22.54,12.61 22.54,12.09 23.52,11.12 | 19.44,7.04 U3.2 18.92,7.04 C13.1 | U6.8 24.89,8.64 v25.32,9.06 24.9,8.65 24.18,8.65 C12.1 | v22.15,6.79 22.33,6.61 23.09,6.61 23.24,6.46 23.24,5.12 23.34,5.02 C10.1 23.39,5.02 23.28,4.91 23.28,4.32 C26.1 23.48,4.02 R3.1 | 25.9,4.06 R4.1 26.67,3.65 27.38,3.65 27.55,3.83 27.55,4.07 | C18.2 25.88,4.07 25.9,4.06 | 27.55,4.07 27.65,4.16 27.65,4.24 27.96,4.55 27.96,4.56 | 27.96,4.56 28.36,4.96 28.36,6.39 28.67,6.7 U7.5 | C27.1 24.33,2.14 v24.47,2 24.49,2 24.62,1.88 C30.1 25.84,1.04 C31.1 | 27.96,4.56 27.96,5.44 C14.1 | R1.1 27.55,4.07 | U6.6 25.91,8.02 25.91,8.4 26.22,8.71 26.44,8.71 v26.62,8.89 26.62,8.98 26.62,8.99 28.02,8.99 | 28.02,8.99 28.07,8.99 v28.09,8.97 | 23.52,11.12 24.74,11.12 24.91,11.29 X4.17 | C13.1 | C13.1 19.02,6.93 19.02,5.59 19.24,5.38 v19.24,4.65 | v18.55,2.93 18.36,2.93 18.16,2.73 17.19,2.73 v16.76,3.16 | v15.59,6.69 15.51,6.69 15.29,6.47 14.61,6.47 R30.2 | U7.5 30.36,6.7 v30.38,6.72 | J1.1 8.02,2.56 v8.02,1.46 | LED2.C 27.74,23.42 LED3.C LED1.C 28.77,24.36 29.39,23.74 29.39,19.71 29.3,19.62 29.3,10.7 v29.46,10.55 | U2.5 13.13,18.25 | U2.4 13.13,18.25 | 13.13,18.25 U2.3 12.93,18.8 U2.2 13.13,19.35 U2.1 | U2.45 U2.1 | U2.19 14.78,11.45 U2.18 12.78,12 U2.15 U2.13 | v11.84,19.52 12.21,19.9 U2.1 | U2.30 21.4,11.12 23.52,11.12
  Bottom 0.152: X1.2 21.23,10.26 21.23,10.76 C4.2 | C5.1 15.53,12.46 U5.13 | v28.19,7.32 28.19,7.1 28.41,6.88 28.41,6.2 24.47,2.27 v24.47,2 24.47,1.88 23.04,0.45 19.3,0.45 18.14,1.6 17.75,1.6 16.76,2.59 v16.76,3.16 16.97,3.37 C23.1 | 20.87,2.23 20.88,2.22 22.28,2.22 22.67,2.61 X1.4 22.15,5.82 v22.15,6.79 22.15,7.42 X1.2 | 20.87,2.23 19.81,3.29 C3.2 19.74,3.72 19.24,4.22 v19.24,4.65 | C5.1 14.83,13.15 | v25.32,9.06 25.32,9.03 | C11.1 28.14,9.02 v28.09,8.97 | v25.32,9.06 25.67,8.71 26.39,8.71 26.57,8.89 v26.62,8.89 | 5.23,14.96 C1.1 5.11,15 C2.1 5.11,19.08 v5.38,19.34 11.66,19.34 v11.84,19.52 | C5.1 14.86,13.19 14.86,15.07 C8.2 15.61,15.82 17.75,15.82 18.2,15.37 18.2,14.92 18.91,14.21 18.96,14.21 U4.2 19.42,13.96 20.6,13.96 21.08,13.48 C7.2 21.96,13.48 R24.2 21.87,13.1 22.34,12.63 v22.56,12.63 v22.56,12.62 22.59,12.59 C15.1 23.37,11.92 23.78,11.51 C22.1 23.78,11.27 24.16,10.88 24.16,8.93 24.37,8.72 24.97,8.72 v25.32,9.06 | U5.25 17.04,5.22 17.04,4.36 16.97,4.29 C23.1 | X1.2 20.34,9.3 | C23.1 16.01,3.8 15.54,4.27 15.54,5.05 15.53,5.05 U5.28 15.53,6.63 v15.59,6.69 | 20.87,2.23 19.67,2.23 C6.2 18.72,2.76 v18.55,2.93
  other vias: 4.36,1.56 3.47,4.3 3.45,5.47 3.12,6.67 14.27,1.05 30.29,0.87 32.63,5.95 23.35,0.74 18.18,0.95
  pour Top: 0.55,-0.98 -0.72,0.29 -0.72,19.34 -0.21,19.85 34.33,19.85 34.84,19.34 34.84,1.56 32.3,-0.98
  pour Bottom: 0.55,-1.23 -0.97,0.29 -0.97,19.09 -0.97,19.34 -0.72,19.59 34.08,19.59 34.59,19.09 34.59,1.56 31.79,-1.23
ILM
  Top 0.152: U6.12 24.53,5.51 24.53,4.07 R3.2
ISET
  Top 0.152: U6.16 26.4,4.66 26.92,4.14 R4.2
LED1
  Top 0.152: R5.2 28.4,22.56 LED1.A
LED2
  Top 0.152: R26.2 26.08,23.55 LED2.A
LED3
  Top 0.152: R27.2 26.08,24.51 LED3.A
NFC1  (1 unrouted)
NFC2  (1 unrouted)
  Bottom 0.152: NFC1.TP 12.54,21.13
P2_AIN0  (1 unrouted)
  Top 0.152: 9.44,13.16 8.68,13.16 8.63,13.11 X3.16
P3_AIN1  (1 unrouted)
  Top 0.152: 9.45,12.07 8.87,12.07 8.64,11.84 X3.18
P4_AIN2  (1 unrouted)
  Top 0.152: 10.59,18.85 10.05,18.85 8.17,20.73 X3.4
P5_AIN3  (1 unrouted)
  Top 0.152: 11.22,10.93 11.22,9.9 10.84,9.52 8.7,9.52 7.64,10.57 X3.20
P7  (1 unrouted)
  Top 0.152: 14.01,10.84 13.62,10.45 12.82,10.45 12.44,10.06 12.44,9.39 11.34,8.29 8.2,8.29 7.49,9 5.62,9 4.85,9.77 4.85,11.9 4.54,12.22 4.54,13.03 4.23,13.33 4.23,14.27 3.93,14.57 3.93,15.31 3.62,15.62 3.62,16.4 3.32,16.71 3.32,17.62 3.01,17.92 3.01,18.74 2.29,19.46 X3.5
P11  (1 unrouted)
  Top 0.152: X4.15 25.9,12.53 23.9,12.53
P12  (1 unrouted)
  Top 0.152: X4.3 25.3,20.18 24.49,19.37
P13  (1 unrouted)
  Top 0.152: X4.11 25.64,14.81 23.99,14.81
P17  (via drill 0.2)  (1 unrouted)
  Top 0.152: v30.22,16.56 30.4,16.37 X4.10
  Bottom 0.152: 15.62,17.69 15.62,17.97 15.98,18.34 28.47,18.34 30.25,16.56 v30.22,16.56
P20  (1 unrouted)
P21  (1 unrouted)
P22  (via drill 0.2)  (1 unrouted)
  Top 0.152: v30.2,15.19 30.29,15.1 X4.12
  Bottom 0.152: 16.59,17.81 16.81,18.03 27.36,18.03 v30.2,15.19
P24  (via drill 0.2)  (1 unrouted)
  Top 0.152: v30.16,12.84 30.43,12.56 X4.16
  Bottom 0.152: v30.16,12.84 25.78,17.22 17.17,17.22
P25  (via drill 0.2)  (1 unrouted)
  Top 0.152: v27.75,19.05 27.75,21.93 27.58,22.1 26.02,22.1 25.69,22.42 R5.1
  Bottom 0.152: v27.75,19.05 27.34,18.64 15.36,18.64
P26_SDA
  Top 0.152: 9.67,17.9 8.6,17.9 8.3,18.19 X3.8
P27_SCL
  Top 0.152: 9.63,16.83 8.61,16.83 8.53,16.92 X3.10
P28_AIN4  (via drill 0.2)  (1 unrouted)
  Top 0.152: v30.22,19.12 31.63,19.12 X4.6
  Bottom 0.152: 13.94,19.07 14.11,19.25 26.42,19.25 27.27,20.1 29.25,20.1 v30.23,19.12 v30.22,19.12
P29_AIN5  (via drill 0.2)  (1 unrouted)
  Top 0.152: v30.15,14.01 30.32,13.83 X4.14
  Bottom 0.152: v30.15,14.01 26.53,17.62 16.88,17.62 15.23,15.98 15.15,15.98 14.44,15.27
P30_AIN6  (via drill 0.2)  (1 unrouted)
  Top 0.152: v30.12,17.95 30.42,17.64 X4.8
  Bottom 0.152: 14.42,18.82 14.54,18.95 26.55,18.95 27.27,19.67 28.4,19.67 v30.12,17.95
P31_AIN7  (1 unrouted)
  Top 0.152: 11.83,10.67 11.83,9.65 11.09,8.9 8.86,8.9 | 8.86,8.9 | 8.86,8.9 8.45,8.9 7.74,9.61 5.87,9.61 5.46,10.02 5.46,12.17 5.17,12.47 5.17,13.27 4.84,13.59 4.84,14.55 4.54,14.85 4.54,15.61 4.23,15.91 4.23,16.7 3.93,17 3.93,17.94 3.62,18.25 3.62,19.11 3.32,19.41 3.32,20.18 3.01,20.49 3.01,21.4 2.41,22 X3.1
P100  (1 unrouted)
  Top 0.152: X4.13 25.79,13.68 23.96,13.68
P103  (1 unrouted)
  Top 0.152: 15.96,9.84 15.96,9.71 15.55,9.31 13.71,9.31 11.78,7.37 7.82,7.37 7.11,8.09 5.24,8.09 3.94,9.39 3.94,11.47 3.62,11.79 3.62,12.63 3.32,12.94 3.32,13.87 3.01,14.17 3.01,14.86 2.22,15.65 X3.11
P104  (1 unrouted)
  Top 0.152: 17.47,9.51 15.52,7.56 12.87,7.56 12.07,6.75 7.58,6.75 6.86,7.48 4.99,7.48 3.32,9.14 3.32,11.21 3.01,11.52 3.01,12.37 2.27,13.11 X3.15
P105  (1 unrouted)
  Top 0.152: X3.19 2.12,10.57 2.7,10 2.7,8.91 4.73,6.87 6.6,6.87 7.33,6.14 13.05,6.14 13.36,5.83 16.77,5.83 17.86,6.93 17.86,8.8 19.21,10.14 19.21,10.67
P106  (1 unrouted)
  Top 0.152: 13.63,10.14 11.48,7.99 8.07,7.99 7.36,8.7 5.49,8.7 4.55,9.64 4.55,11.77 4.23,12.08 4.23,12.9 3.93,13.2 3.93,14.13 3.62,14.44 3.62,15.17 3.32,15.47 3.32,16.27 3.01,16.57 3.01,17.44 2.26,18.19 X3.7
P107  (via drill 0.2)  (1 unrouted)
  Top 0.152: v30.17,11.78 30.65,11.29 X4.18
  Bottom 0.152: v30.17,11.78 25.1,16.85 17.14,16.85 v16.79,16.5
P108  (1 unrouted)
  Top 0.152: 13.78,9.84 11.62,7.68 7.95,7.68 7.24,8.39 5.36,8.39 4.24,9.51 4.24,11.64 3.93,11.96 3.93,12.77 3.62,13.07 3.62,14.01 3.32,14.31 3.32,15 3.01,15.31 3.01,16.13 2.22,16.92 X3.9
P109  (1 unrouted)
  Top 0.152: 24.49,20.65 25.3,21.46 X4.1
P110
  Top 0.152: X3.3 2.29,20.73 3.01,20.01 3.01,19.23 3.32,18.92 3.32,18.06 3.62,17.75 3.62,16.84 3.93,16.53 3.93,15.76 4.23,15.46 4.23,14.72 4.54,14.41 4.54,13.46 4.86,13.14 4.86,12.33 5.16,12.04 5.16,9.89 5.74,9.31 7.61,9.31 8.32,8.6 11.22,8.6 12.14,9.52 12.14,10.19 12.62,10.67
P111  (via drill 0.2)
  Top 0.152: v30.22,21.23 30.44,21.45 X4.2
  Bottom 0.152: 12.83,18.17 13.15,18.49 13.15,19.4 13.61,19.86 26.14,19.86 27.51,21.23 v30.22,21.23 30.23,21.23
P112  (via drill 0.2)
  Top 0.152: v30.14,20.36 31.66,20.36 X4.4
  Bottom 0.152: 13.46,19.26 13.76,19.56 26.26,19.56 27.3,20.59 29.91,20.59 v30.14,20.36
P113
  Top 0.152: 10.72,19.16 10.27,19.16 9.06,20.37 9.06,21.23 8.28,22 X3.2
P114
  Top 0.152: 10.46,18.53 9.19,18.53 8.25,19.46 X3.6
P115
  Top 0.152: 11.53,10.8 11.53,9.77 10.97,9.21 8.57,9.21 7.87,9.92 6,9.92 5.77,10.15 5.77,12.31 5.47,12.61 5.47,13.48 5.19,13.75 5.19,14.74 6.1,15.65 X3.12
PGOOD  (via drill 0.2)
  Top 0.152: U6.7 25.4,8.46 26.02,9.08 v26.02,9.19 | v27.6,10.76 27.6,12.54 v27.62,12.56
  Bottom 0.152: v26.02,9.19 26.02,9.44 R28.2 26.18,10.22 26.56,10.61 27.32,10.61 27.47,10.76 v27.6,10.76 | 19.76,15.86 19.86,15.96 24.28,15.96 27.62,12.62 v27.62,12.56
RESET  (via drill 0.2)
  Top 0.152: v22.53,13.31 22.74,13.52 22.74,14.26 24.04,15.56 24.04,16.21 23.88,16.37 | X4.9 23.88,16.37 | U2.40 23.1,17.15 23.88,16.37
  Bottom 0.152: R2.1 23.2,13.58 22.8,13.58 v22.53,13.31
SCLK  (via drill 0.2)  (1 unrouted)
  Top 0.152: 16.54,11.39 16.54,9.47 15.88,8.81 14.49,8.81 v14.49,8.78 13.64,8.78 11.92,7.06 7.7,7.06 6.98,7.78 5.11,7.78 3.63,9.27 3.63,11.34 3.32,11.65 3.32,12.5 3.01,12.81 3.01,13.74 2.36,14.38 X3.13
  Bottom 0.152: v14.49,8.78 14.88,9.16 18.03,9.16
SWDCLK  (1 unrouted)
  Top 0.152: X4.7 23.12,17.64 22.53,18.24
SWDIO  (1 unrouted)
  Top 0.152: X4.5 21.94,18.91 21.88,18.86
SYNC/RESET  (via drill 0.2)
  Top 0.152: v15.56,10.43 15.94,10.43 16.09,10.57
  Bottom 0.152: U5.16 17.02,11.61 17.02,10.68 16.77,10.43 v15.56,10.43
TS
  Top 0.152: R1.2 27.54,4.8 27.54,5.37 U6.1
VDD  (via drill 0.2)  (2 unrouted)
  Top 0.152: U3.5 22.4,8.02 23.06,8.67 C12.2 23.68,8.86 v23.68,9.3 | U3.5 22.73,7.67 v22.73,7.09 | v23.68,9.3 23.68,9.21 | v24.67,9.21 23.77,9.21 v23.68,9.3 | X4.19 25.02,10.02 | 25.02,10.02 25,10.04 | U2.14 U2.56 16.16,13.03 16.16,14.1 | v23.68,9.3 24.4,10.02 25.02,10.02 | 21.54,10.64 | U3.5 22.4,9.78 21.54,10.64
  Bottom 0.152: U5.26 16.53,6.18 17.39,6.18 17.39,4.03 C23.2 17.62,2.6 18.3,1.92 22.45,1.92 23.56,3.03 23.56,6.34 23.32,6.58 23.17,6.58 22.73,7.01 v22.73,7.09 | v22.73,7.09 22.73,6.98 | R31.2 20.26,12.69 20.87,12.69 22.59,10.97 C15.2 23.5,10.82 23.68,10.64 v23.68,9.3 | R2.2 23.66,13 24.43,12.24 C22.2 | C22.2 24.5,11.25 24.5,9.38 v24.67,9.21 | R29.1 24.08,7.08 23.61,7.55 23.18,7.55 v22.73,7.1 v22.73,7.09 | R28.1 24.41,11.32 C22.2
VIN  (via drill 0.2)  (1 unrouted)
  Top 0.152: S1.2 18.48,5.24 | S1.2 18.17,7.48 C13.2 19.85,7.94 U3.1 20.23,7.99 | 20.36,6.09 U3.3 19.88,6.07 19.88,4.38 19.65,4.15 18.35,4.15 18.17,4.32 S1.2 | v17.71,15.16 17.75,15.16 17.75,15.29 18.08,15.62 18.67,15.62 18.98,15.92 v18.98,15.96
  Bottom 0.152: v17.71,15.16 17.71,14.38 18.73,13.36 U4.3 19.16,13.46 20.37,13.46 C7.1 | U4.1 19.17,15.16 18.98,15.16 v18.98,15.96
VSWITCH  (via drill 0.2)
  Top 0.152: 23.86,6.54 23.86,6.82 U6.10 | 23.86,6.54 23.86,6.32 U6.11 | v24.04,4.66 24.04,5.12 23.55,5.61 23.55,6.44 | S1.3 19.72,1.04 v19.66,1.1 | U6.5 26.47,8.01 26.88,8.42 v27.58,8.42 | v23.4,7.06 23.4,6.94 23.55,6.78 23.55,6.44 | 23.86,6.54 23.75,6.44 23.55,6.44
  Bottom 0.152: v24.04,4.66 24.04,3.02 22.61,1.59 20.15,1.59 v19.66,1.1 | v23.4,7.06 23.4,6.95 24.92,5.42 26.52,5.42 27.29,6.18 27.29,8.12 v27.58,8.42 27.49,8.52 C11.2
XTAL1_1  (via drill 0.2)  (1 unrouted)
  Top 0.152: v10.94,17.23 10.94,16.53 10.05,15.64
  Bottom 0.152: v10.94,17.23 10.39,16.68 X2.2 7.28,16.59 C2.2
XTAL2_1  (via drill 0.2)  (1 unrouted)
  Top 0.152: v10.93,15.84 10.7,15.6 10.7,15.19 10.05,14.54
  Bottom 0.152: v10.93,15.84 10.33,15.23 7.62,15.23 X2.1 7.35,14.96 C1.2

### Text on the board
tPlace: BT40/BT840 / Or Other BT-Series
bPlace: BT(8)40 + ADS131M08 / JOSHUA BREWSTER / BOJAN JOVANOVICH / AGPL v3 LICENSE
bNames: SWDIO | SWDCLK | RESET | 7+ | 7- | GND | 3.3V | 0+ | 0-
tValues: G | V
Document: RESET | SWDIO | SWO | SWDCLK | GND | VDD